# EAGLE design cbjt-adc-demo (EAGLE 9.6.1)
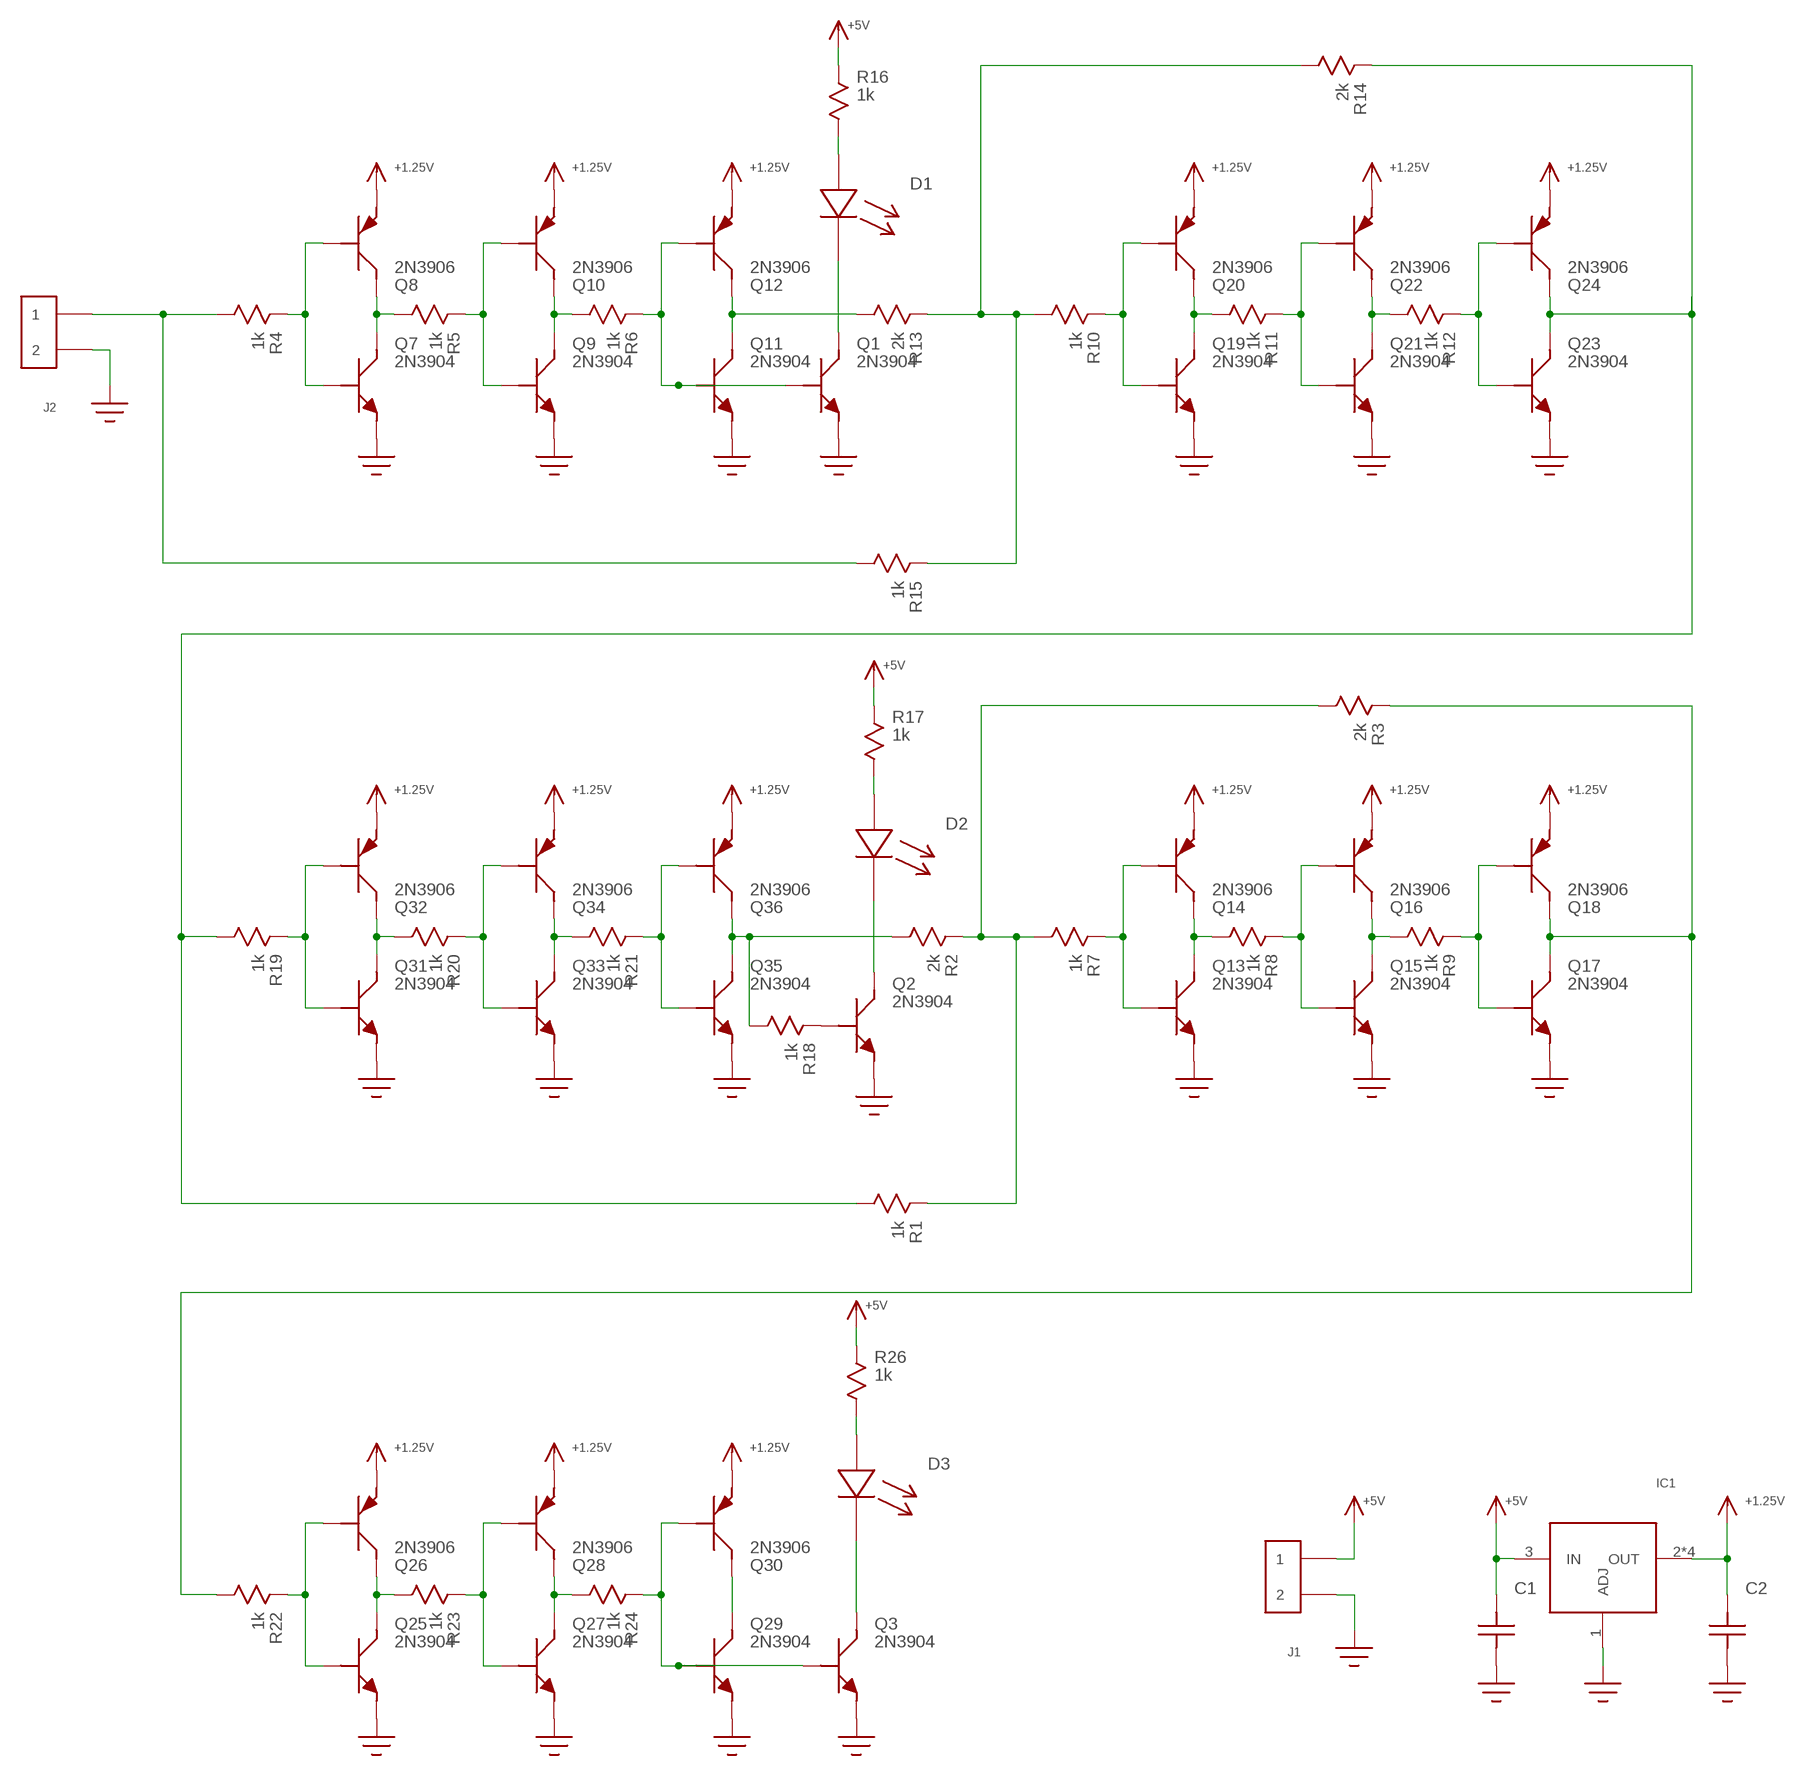
[diagram p0: schematic, sheet 1]

## Parts
C1  C100MIL  [C-100MIL]
C2  C100MIL  [C-100MIL]
D1  LED5MM  [LED-5MM]
D2  LED5MM  [LED-5MM]
D3  LED5MM  [LED-5MM]
IC1  LM317  [TO-220]
J1  HEADER_2PIN  [HEADER_2PIN]
J2  HEADER_2PIN  [HEADER_2PIN]
Q1  2N3904  NPNTO-92-EBC  [TO-92]
Q2  2N3904  NPNTO-92-EBC  [TO-92]
Q3  2N3904  NPNTO-92-EBC  [TO-92]
Q7  2N3904  NPNTO-92-EBC  [TO-92]
Q8  2N3906  PNPTO-92-EBC  [TO-92]
Q9  2N3904  NPNTO-92-EBC  [TO-92]
Q10  2N3906  PNPTO-92-EBC  [TO-92]
Q11  2N3904  NPNTO-92-EBC  [TO-92]
Q12  2N3906  PNPTO-92-EBC  [TO-92]
Q13  2N3904  NPNTO-92-EBC  [TO-92]
Q14  2N3906  PNPTO-92-EBC  [TO-92]
Q15  2N3904  NPNTO-92-EBC  [TO-92]
Q16  2N3906  PNPTO-92-EBC  [TO-92]
Q17  2N3904  NPNTO-92-EBC  [TO-92]
Q18  2N3906  PNPTO-92-EBC  [TO-92]
Q19  2N3904  NPNTO-92-EBC  [TO-92]
Q20  2N3906  PNPTO-92-EBC  [TO-92]
Q21  2N3904  NPNTO-92-EBC  [TO-92]
Q22  2N3906  PNPTO-92-EBC  [TO-92]
Q23  2N3904  NPNTO-92-EBC  [TO-92]
Q24  2N3906  PNPTO-92-EBC  [TO-92]
Q25  2N3904  NPNTO-92-EBC  [TO-92]
Q26  2N3906  PNPTO-92-EBC  [TO-92]
Q27  2N3904  NPNTO-92-EBC  [TO-92]
Q28  2N3906  PNPTO-92-EBC  [TO-92]
Q29  2N3904  NPNTO-92-EBC  [TO-92]
Q30  2N3906  PNPTO-92-EBC  [TO-92]
Q31  2N3904  NPNTO-92-EBC  [TO-92]
Q32  2N3906  PNPTO-92-EBC  [TO-92]
Q33  2N3904  NPNTO-92-EBC  [TO-92]
Q34  2N3906  PNPTO-92-EBC  [TO-92]
Q35  2N3904  NPNTO-92-EBC  [TO-92]
Q36  2N3906  PNPTO-92-EBC  [TO-92]
R1  1k  RTH-0.25W  [R-0.25W]
R2  2k  RTH-0.25W  [R-0.25W]
R3  2k  RTH-0.25W  [R-0.25W]
R4  1k  RTH-0.25W  [R-0.25W]
R5  1k  RTH-0.25W  [R-0.25W]
R6  1k  RTH-0.25W  [R-0.25W]
R7  1k  RTH-0.25W  [R-0.25W]
R8  1k  RTH-0.25W  [R-0.25W]
R9  1k  RTH-0.25W  [R-0.25W]
R10  1k  RTH-0.25W  [R-0.25W]
R11  1k  RTH-0.25W  [R-0.25W]
R12  1k  RTH-0.25W  [R-0.25W]
R13  2k  RTH-0.25W  [R-0.25W]
R14  2k  RTH-0.25W  [R-0.25W]
R15  1k  RTH-0.25W  [R-0.25W]
R16  1k  RTH-0.25W  [R-0.25W]
R17  1k  RTH-0.25W  [R-0.25W]
R18  1k  RTH-0.25W  [R-0.25W]
R19  1k  RTH-0.25W  [R-0.25W]
R20  1k  RTH-0.25W  [R-0.25W]
R21  1k  RTH-0.25W  [R-0.25W]
R22  1k  RTH-0.25W  [R-0.25W]
R23  1k  RTH-0.25W  [R-0.25W]
R24  1k  RTH-0.25W  [R-0.25W]
R26  1k  RTH-0.25W  [R-0.25W]

## Nets
+1.25V: C2.P$2 IC1.2(OUT) IC1.HS@1(OUT) IC1.HS@2(OUT) IC1.HS@3(OUT) Q8.1(E) Q10.1(E) Q12.1(E) Q14.1(E) Q16.1(E) Q18.1(E) Q20.1(E) Q22.1(E) Q24.1(E) Q26.1(E) Q28.1(E) Q30.1(E) Q32.1(E) Q34.1(E) Q36.1(E)
+5V: C1.P$2 IC1.3(IN) J1.1 R16.P$1 R17.P$1 R26.P$1
GND: C1.P$1 C2.P$1 IC1.1(ADJ) J1.2 J2.2 Q1.1(E) Q2.1(E) Q3.1(E) Q7.1(E) Q9.1(E) Q11.1(E) Q13.1(E) Q15.1(E) Q17.1(E) Q19.1(E) Q21.1(E) Q23.1(E) Q25.1(E) Q27.1(E) Q29.1(E) Q31.1(E) Q33.1(E) Q35.1(E)
N$1: R1.P$1 R2.P$1 R3.P$2 R7.P$2
N$2: D1.C Q1.3(C)
N$3: D1.A R16.P$2
N$4: Q2.2(B) R18.P$1
N$5: D2.C Q2.3(C)
N$6: D2.A R17.P$2
N$7: Q7.3(C) Q8.3(C) R5.P$2
N$8: Q7.2(B) Q8.2(B) R4.P$1
N$9: Q9.3(C) Q10.3(C) R6.P$2
N$10: Q9.2(B) Q10.2(B) R5.P$1
N$11: Q11.3(C) Q12.3(C) R13.P$2
N$12: Q1.2(B) Q11.2(B) Q12.2(B) R6.P$1
N$13: Q13.3(C) Q14.3(C) R8.P$2
N$14: Q13.2(B) Q14.2(B) R7.P$1
N$15: Q15.3(C) Q16.3(C) R9.P$2
N$16: Q15.2(B) Q16.2(B) R8.P$1
N$17: Q17.3(C) Q18.3(C) R3.P$1 R22.P$2
N$18: Q17.2(B) Q18.2(B) R9.P$1
N$19: Q19.3(C) Q20.3(C) R11.P$2
N$20: Q19.2(B) Q20.2(B) R10.P$1
N$21: Q21.3(C) Q22.3(C) R12.P$2
N$22: Q21.2(B) Q22.2(B) R11.P$1
N$23: Q23.3(C) Q24.3(C) R1.P$2 R14.P$1 R19.P$2
N$24: Q23.2(B) Q24.2(B) R12.P$1
N$25: R10.P$2 R13.P$1 R14.P$2 R15.P$1
N$27: J2.1 R4.P$2 R15.P$2
N$28: Q25.3(C) Q26.3(C) R23.P$2
N$29: Q25.2(B) Q26.2(B) R22.P$1
N$30: Q27.3(C) Q28.3(C) R24.P$2
N$31: Q27.2(B) Q28.2(B) R23.P$1
N$32: Q29.3(C) Q30.3(C)
N$33: Q3.2(B) Q29.2(B) Q30.2(B) R24.P$1
N$34: Q31.3(C) Q32.3(C) R20.P$2
N$35: Q31.2(B) Q32.2(B) R19.P$1
N$36: Q33.3(C) Q34.3(C) R21.P$2
N$37: Q33.2(B) Q34.2(B) R20.P$1
N$38: Q35.3(C) Q36.3(C) R2.P$2 R18.P$2
N$39: Q35.2(B) Q36.2(B) R21.P$1
N$40: D3.C Q3.3(C)
N$41: D3.A R26.P$2

## Library data of the parts
C1 C2 = yapo:C
D1-D3 = yapo:LED
IC1 = yapo:LM317
J1 J2 = yapo:HEADER_2PIN
Q1-Q3 Q7 Q9 Q11 Q13 Q15 Q17 Q19 Q21 Q23 Q25 Q27 Q29 Q31 Q33 Q35 = yapo:NPN
Q8 Q10 Q12 Q14 Q16 Q18 Q20 Q22 Q24 Q26 Q28 Q30 Q32 Q34 Q36 = yapo:PNP
R1-R24 R26 = yapo:R

## Board
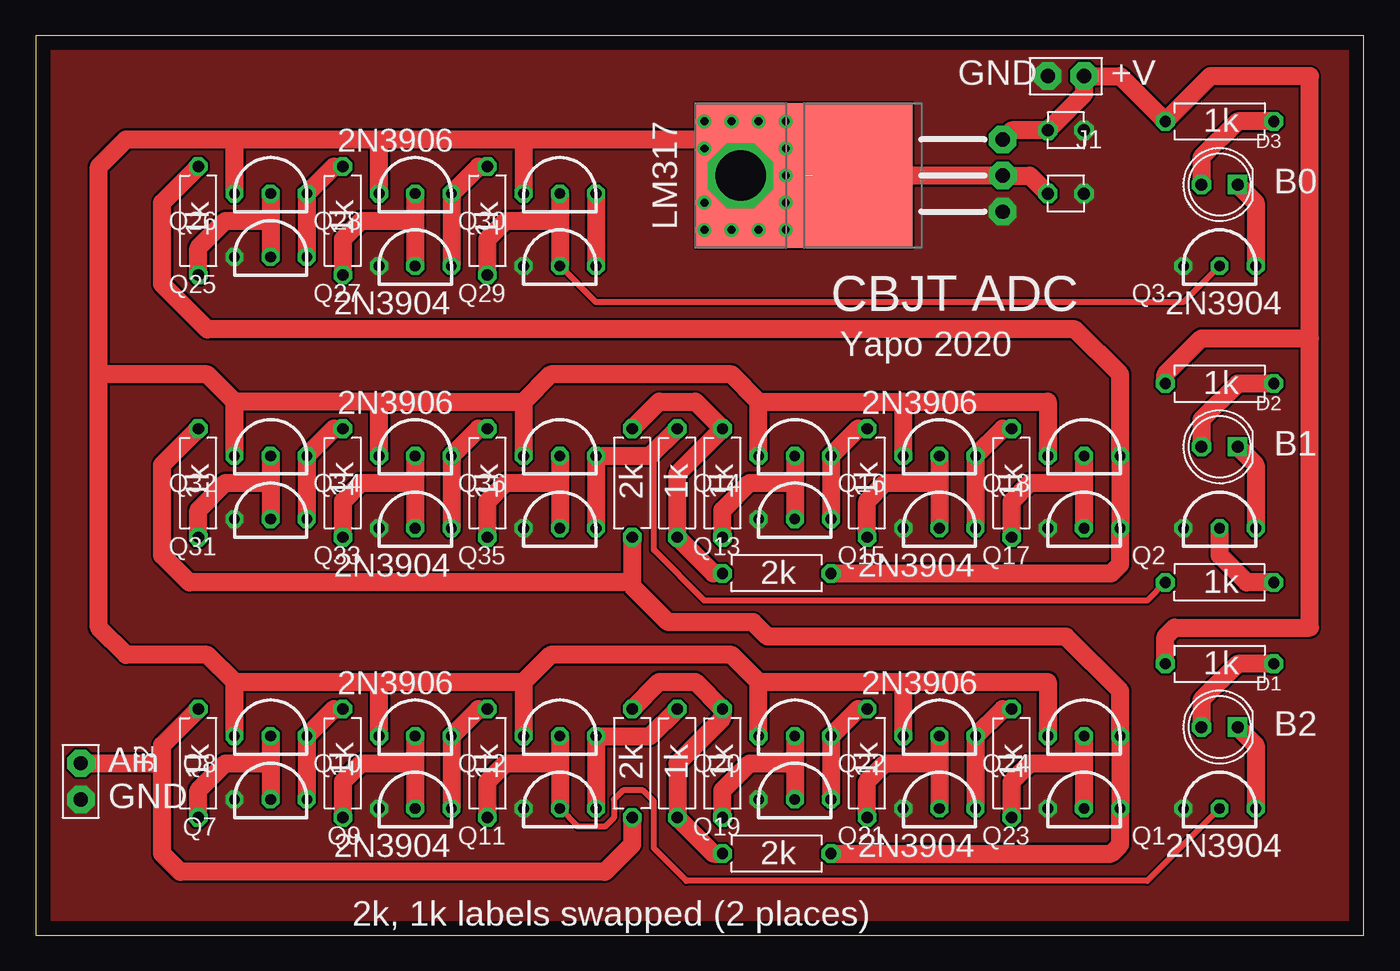
[diagram p1: board, top side]
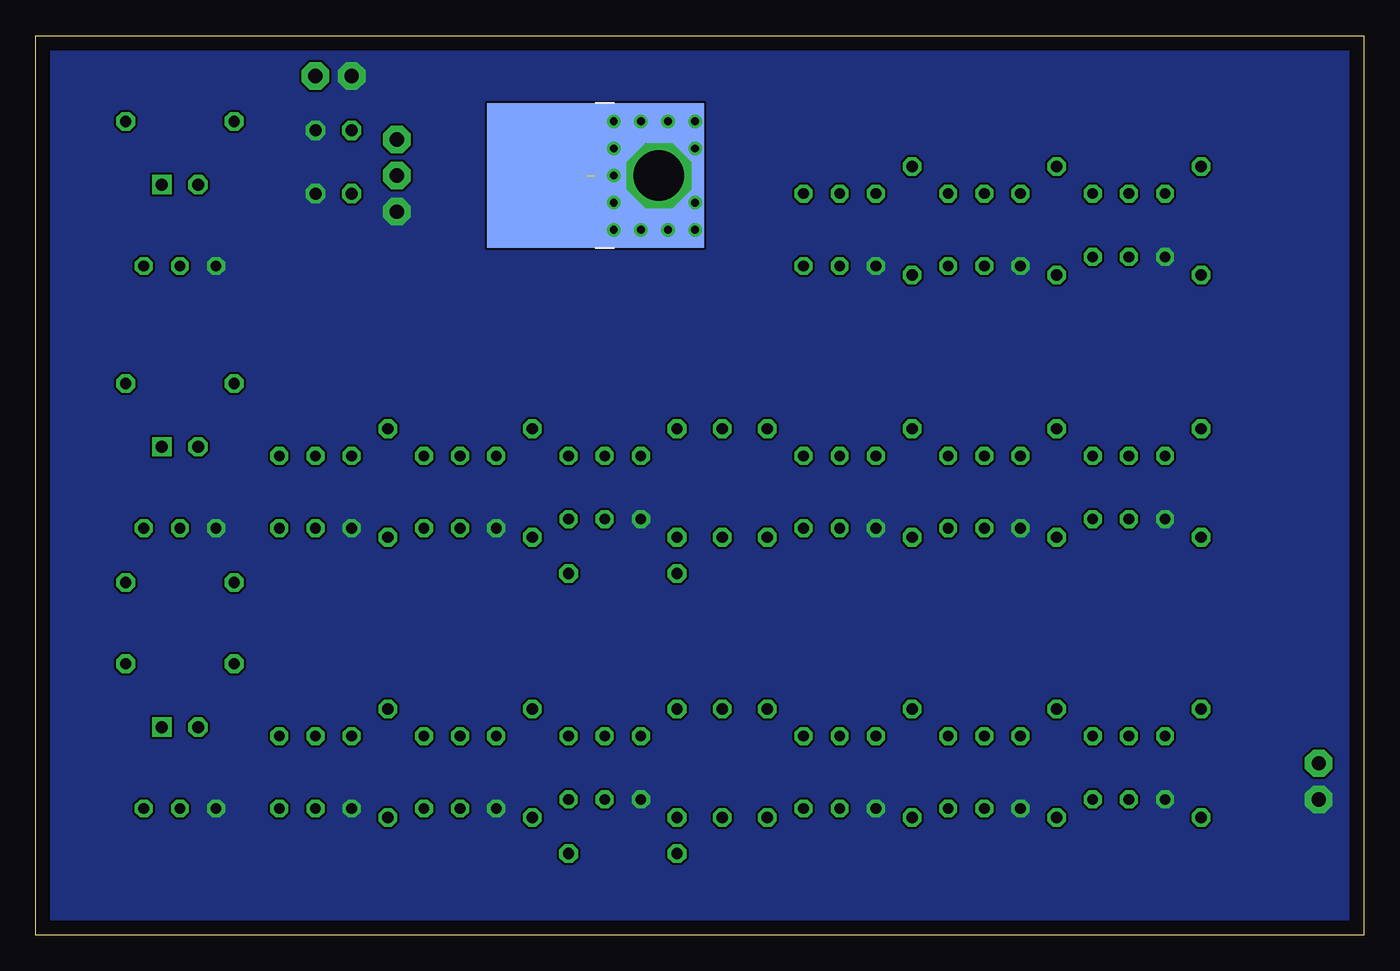
[diagram p2: board, bottom side, seen from below]

Size 93.33 x 63.17 mm. Coordinates in mm from the lower left corner, seen from the top.
Outline: 0,0 93.33,0 93.33,63.17 0,63.17 0,0
Copper layers (1*16): Top 0.035mm / dielectric 1.5mm / Bottom 0.035mm
Design rules "default": minimum track width 6mil, minimum drill 0.35mm, track to track 6mil, track to pad 6mil, pad to pad 6mil, via to via 6mil, smd to smd 6mil, copper to edge 40mil, drill to drill 6mil, minimum pad ring 10mil, minimum via ring 8mil, stop-mask expansion 4mil, vias tented up to drill 0mil, thermal gap 10mil

### Footprints (pad centres in the part's own frame; a part is rotated, then mirrored left to right if it is on the bottom)
C-100MIL = drill 0.85 octagon: P$1 -1.27,0; P$2 1.27,0
LED-5MM = drill 0.85 octagon: A -1.27,0 | drill 0.85 square: C 1.27,0
TO-220 = drill 1 pad 1.93 octagon: 1 -2.54,-18.415; 2 0,-18.415; 3 2.54,-18.415 | drill 3.556 octagon: HS@1 0,0 | smd 10.16 x 15.24: HS@2 0,-4.445 | smd 10.16 x 15.24 bottom: HS@3 0,-4.445
HEADER_2PIN = drill 1 pad 1.93 octagon: 1 -1.27,0; 2 1.27,0
TO-92 = drill 0.75 octagon: 1 2.54,0; 2 0,0; 3 -2.54,0
R-0.25W = drill 0.8 octagon: P$1 -3.81,0; P$2 3.81,0

### Placement (x,y rotation side)
C1  72.39,56.52 180 top
C2  72.39,52.07 180 top
D1  83.19,14.61 0 top
D2  83.19,34.29 0 top
D3  83.19,52.7 0 top
IC1  49.53,53.34 90 top
J1  72.39,60.33 180 top
J2  3.17,10.79 270 top
Q1  83.19,8.89 180 top
Q2  83.19,28.57 180 top
Q3  83.19,46.99 180 top
Q7  16.51,9.53 180 top
Q8  16.51,13.97 180 top
Q9  26.67,8.89 180 top
Q10  26.67,13.97 180 top
Q11  36.83,8.89 180 top
Q12  36.83,13.97 180 top
Q13  53.34,29.21 180 top
Q14  53.34,33.66 180 top
Q15  63.5,28.57 180 top
Q16  63.5,33.66 180 top
Q17  73.66,28.57 180 top
Q18  73.66,33.66 180 top
Q19  53.34,9.53 180 top
Q20  53.34,13.97 180 top
Q21  63.5,8.89 180 top
Q22  63.5,13.97 180 top
Q23  73.66,8.89 180 top
Q24  73.66,13.97 180 top
Q25  16.51,47.62 180 top
Q26  16.51,52.07 180 top
Q27  26.67,46.99 180 top
Q28  26.67,52.07 180 top
Q29  36.83,46.99 180 top
Q30  36.83,52.07 180 top
Q31  16.51,29.21 180 top
Q32  16.51,33.66 180 top
Q33  26.67,28.57 180 top
Q34  26.67,33.66 180 top
Q35  36.83,28.57 180 top
Q36  36.83,33.66 180 top
R1  41.91,31.75 270 top
R2  45.09,31.75 90 top
R3  52.07,25.4 180 top
R4  11.43,12.06 90 top
R5  21.59,12.06 90 top
R6  31.75,12.06 90 top
R7  48.26,31.75 90 top
R8  58.42,31.75 90 top
R9  68.58,31.75 90 top
R10  48.26,12.06 90 top
R11  58.42,12.06 90 top
R12  68.58,12.06 90 top
R13  45.09,12.06 90 top
R14  52.07,5.71 180 top
R15  41.91,12.06 270 top
R16  83.19,19.05 0 top
R17  83.19,38.73 0 top
R18  83.19,24.77 180 top
R19  11.43,31.75 90 top
R20  21.59,31.75 90 top
R21  31.75,31.75 90 top
R22  11.43,50.16 90 top
R23  21.59,50.16 90 top
R24  31.75,50.16 90 top
R26  83.19,57.15 0 top

### Tracks (layer width: path | path; a pad name or v marks a point on that pad's centre or on a via)
+1.25V  (via drill 0.55)  (2 unrouted)
  Top 1.27: Q8.1 13.97,17.78 | 13.97,17.78 24.13,17.78 | 24.13,17.78 34.29,17.78 | 34.29,17.78 Q12.1 | Q10.1 24.13,17.78 | Q20.1 50.8,17.78 | 50.8,17.78 60.96,17.78 | 60.96,17.78 71.12,17.78 Q24.1 | Q22.1 60.96,17.78 | Q32.1 13.97,37.47 | 24.13,37.47 13.97,37.47 | 24.13,37.47 34.29,37.47 | 34.29,37.47 Q36.1 | Q34.1 24.13,37.47 | Q14.1 50.8,37.47 | 50.8,37.47 60.96,37.47 | 60.96,37.47 71.12,37.47 Q18.1 | Q16.1 60.96,37.47 | 13.97,55.88 24.13,55.88 | 24.13,55.88 34.29,55.88 | 34.29,55.88 Q30.1 | Q28.1 24.13,55.88 | 34.29,17.78 36.2,19.68 48.9,19.68 50.8,17.78 | 50.8,37.47 48.9,39.37 36.2,39.37 34.29,37.47 | 13.97,17.78 12.06,19.68 6.35,19.68 4.45,21.59 4.45,39.37 | 13.97,55.88 6.35,55.88 4.45,53.98 4.45,39.37 | 13.97,37.47 12.06,39.37 4.45,39.37 | Q26.1 13.97,55.88 | 55.88,53.34 IC1.2 69.85,53.34 C2.P$2 | 55.88,53.34 54.61,53.34 | 34.29,55.88 53.34,55.88 55.88,53.34 | IC1.HS@3 v52.7,53.34 IC1.HS@1
+5V
  Top 1.27: R16.P$1 79.38,20.95 80.01,21.59 89.53,21.59 89.53,41.91 | 89.53,41.91 89.53,60.33 82.55,60.33 R26.P$1 76.2,60.33 J1.1 73.66,59.05 C1.P$2 68.58,56.52 IC1.3 | R17.P$1 79.38,39.37 81.92,41.91 89.53,41.91
GND
  pour Top (no thermals): -4.45,67.31 97.16,67.31 97.16,-3.17 -4.45,-3.17
  pour Bottom (no thermals): -8.26,70.48 100.33,70.48 100.33,-6.99 -8.26,-6.99
N$1
  Top 1.27: R3.P$2 47.62,25.4 R2.P$1 45.09,32.38 R7.P$2 46.35,37.47 43.81,37.47 R1.P$1
N$2
  Top 1.27: D1.C 85.72,13.34 Q1.3
N$3
  Top 1.27: R16.P$2 84.45,19.05 81.92,16.51 D1.A
N$4
  Top 1.27: R18.P$1 85.09,24.77 83.19,26.67 Q2.2
N$5
  Top 1.27: D2.C 85.72,33.02 Q2.3
N$6
  Top 1.27: R17.P$2 84.45,38.73 81.92,36.2 D2.A
N$7
  Top 1.27: Q7.3 Q8.3 20.95,15.88 R5.P$2
N$8
  Top 1.27: Q8.2 16.51,12.06 | 16.51,12.06 Q7.2 | R4.P$1 11.43,10.16 13.34,12.06 16.51,12.06
N$9
  Top 1.27: Q9.3 Q10.3 31.11,15.88 R6.P$2
N$10
  Top 1.27: Q10.2 26.67,12.06 | 26.67,12.06 Q9.2 | R5.P$1 21.59,10.79 22.86,12.06 26.67,12.06
N$11
  Top 1.27: Q11.3 Q12.3 43.18,13.97 R13.P$2
N$12
  Top 0.406: Q1.2 78.11,3.81 45.72,3.81 43.43,6.1 43.43,9.4 42.67,10.16 41.27,10.16 40.64,9.53 40.64,8.26 40.01,7.62 38.1,7.62 Q11.2
  Top 1.27: Q12.2 36.83,12.06 | 36.83,12.06 Q11.2 | R6.P$1 31.75,10.79 33.02,12.06 36.83,12.06
N$13
  Top 1.27: Q13.3 Q14.3 57.78,35.56 R8.P$2
N$14
  Top 1.27: Q14.2 53.34,31.75 | 53.34,31.75 Q13.2 | R7.P$1 48.26,29.84 50.16,31.75 53.34,31.75
N$15
  Top 1.27: Q15.3 Q16.3 67.94,35.56 R9.P$2
N$16
  Top 1.27: Q16.2 63.5,31.75 | 63.5,31.75 Q15.2 | R8.P$1 58.42,30.48 59.69,31.75 63.5,31.75
N$17
  Top 1.27: R3.P$1 75.56,25.4 76.2,26.04 Q17.3 Q18.3 76.2,39.37 73.03,42.55 12.06,42.55 8.89,45.72 8.89,51.44 R22.P$2
N$18
  Top 1.27: Q18.2 73.66,31.75 | 73.66,31.75 Q17.2 | R9.P$1 68.58,30.48 69.85,31.75 73.66,31.75
N$19
  Top 1.27: Q19.3 Q20.3 57.78,15.88 R11.P$2
N$20
  Top 1.27: Q20.2 53.34,12.06 | 53.34,12.06 Q19.2 | R10.P$1 48.26,10.16 50.16,12.06 53.34,12.06
N$21
  Top 1.27: Q21.3 Q22.3 67.94,15.88 R12.P$2
N$22
  Top 1.27: Q22.2 63.5,12.06 | 63.5,12.06 Q21.2 | R11.P$1 58.42,10.79 59.69,12.06 63.5,12.06
N$23
  Top 1.27: R14.P$1 75.56,5.71 76.2,6.35 Q23.3 Q24.3 76.2,17.14 72.39,20.95 51.44,20.95 50.42,21.97 44.45,21.97 41.91,24.51 41.91,24.77 | R1.P$2 41.91,24.77 | 41.91,24.77 10.79,24.77 8.89,26.67 8.89,33.02 R19.P$2
N$24
  Top 1.27: Q24.2 73.66,12.06 | 73.66,12.06 Q23.2 | R12.P$1 68.58,10.79 69.85,12.06 73.66,12.06
N$25
  Top 1.27: R15.P$1 43.81,17.78 46.35,17.78 R10.P$2 48.26,15.24 45.09,12.06 R13.P$1 47.62,5.71 R14.P$2
N$26  (via drill 0.55)
  other vias: 52.7,55.24
N$27
  Top 1.27: R15.P$2 41.91,6.35 40.01,4.45 10.16,4.45 8.89,5.71 8.89,12.06 | 8.89,12.06 8.89,13.34 R4.P$2 | J2.1 8.89,12.06
N$28
  Top 1.27: Q25.3 Q26.3 20.95,53.98 R23.P$2
N$29
  Top 1.27: Q26.2 16.51,50.16 | 16.51,50.16 Q25.2 | R22.P$1 11.43,48.26 13.34,50.16 16.51,50.16
N$30
  Top 1.27: Q27.3 Q28.3 31.11,53.98 R24.P$2
N$31
  Top 1.27: Q28.2 26.67,50.16 | 26.67,50.16 Q27.2 | R23.P$1 21.59,48.9 22.86,50.16 26.67,50.16
N$32
  Top 1.27: Q30.3 Q29.3
N$33
  Top 0.406: Q3.2 80.64,44.45 39.37,44.45 Q29.2
  Top 1.27: Q30.2 36.83,50.16 | 36.83,50.16 Q29.2 | R24.P$1 31.75,48.9 33.02,50.16 36.83,50.16
N$34
  Top 1.27: Q31.3 Q32.3 20.95,35.56 R20.P$2
N$35
  Top 1.27: Q32.2 16.51,31.75 | 16.51,31.75 Q31.2 | R19.P$1 11.43,29.84 13.34,31.75 16.51,31.75
N$36
  Top 1.27: Q33.3 Q34.3 31.11,35.56 R21.P$2
N$37
  Top 1.27: Q34.2 26.67,31.75 | 26.67,31.75 Q33.2 | R20.P$1 21.59,30.48 22.86,31.75 26.67,31.75
N$38
  Top 0.406: R18.P$2 78.11,23.5 46.99,23.5 43.43,27.05 43.43,33.4 43.18,33.66
  Top 1.27: Q35.3 Q36.3 43.18,33.66 R2.P$2
N$39
  Top 1.27: Q36.2 36.83,31.75 | 36.83,31.75 Q35.2 | R21.P$1 31.75,30.48 33.02,31.75 36.83,31.75
N$40
  Top 1.27: D3.C 85.72,51.44 Q3.3
N$41
  Top 1.27: R26.P$2 84.45,57.15 81.92,54.61 D3.A
N$42  (via drill 0.55)
  other vias: 52.7,57.15
N$43  (via drill 0.55)
  other vias: 52.7,51.44
N$44  (via drill 0.55)
  other vias: 52.7,49.53
N$45  (via drill 0.55)
  other vias: 50.8,49.53
N$46  (via drill 0.55)
  other vias: 48.9,49.53
N$47  (via drill 0.55)
  other vias: 46.99,49.53
N$48  (via drill 0.55)
  other vias: 50.8,57.15
N$49  (via drill 0.55)
  other vias: 48.9,57.15
N$50  (via drill 0.55)
  other vias: 46.99,57.15
N$51  (via drill 0.55)
  other vias: 46.99,55.24
N$52  (via drill 0.55)
  other vias: 46.99,51.44

### Text on the board
tPlace: GND | +V | 1k | 2N3906 | B0 | LM317 | 1k | 1k | 1k | 2N3904 | CBJT ADC | 2N3904 | Yapo 2020 | 1k | 2N3906 | 2N3906 | B1 | 1k | 1k | 1k | 2k | 1k | 1k | 1k | 1k | 2N3904 | 2k | 2N3904 | 1k | 1k | 2N3906 | 2N3906 | B2 | Ain | 1k | 1k | 1k | 2k | 1k | 1k | 1k | 1k | GND | 2N3904 | 2k | 2N3904 | 2N3904 | 2k, 1k labels swapped (2 places)